# EAGLE schematic jkff v8 (EAGLE 9.7.0)
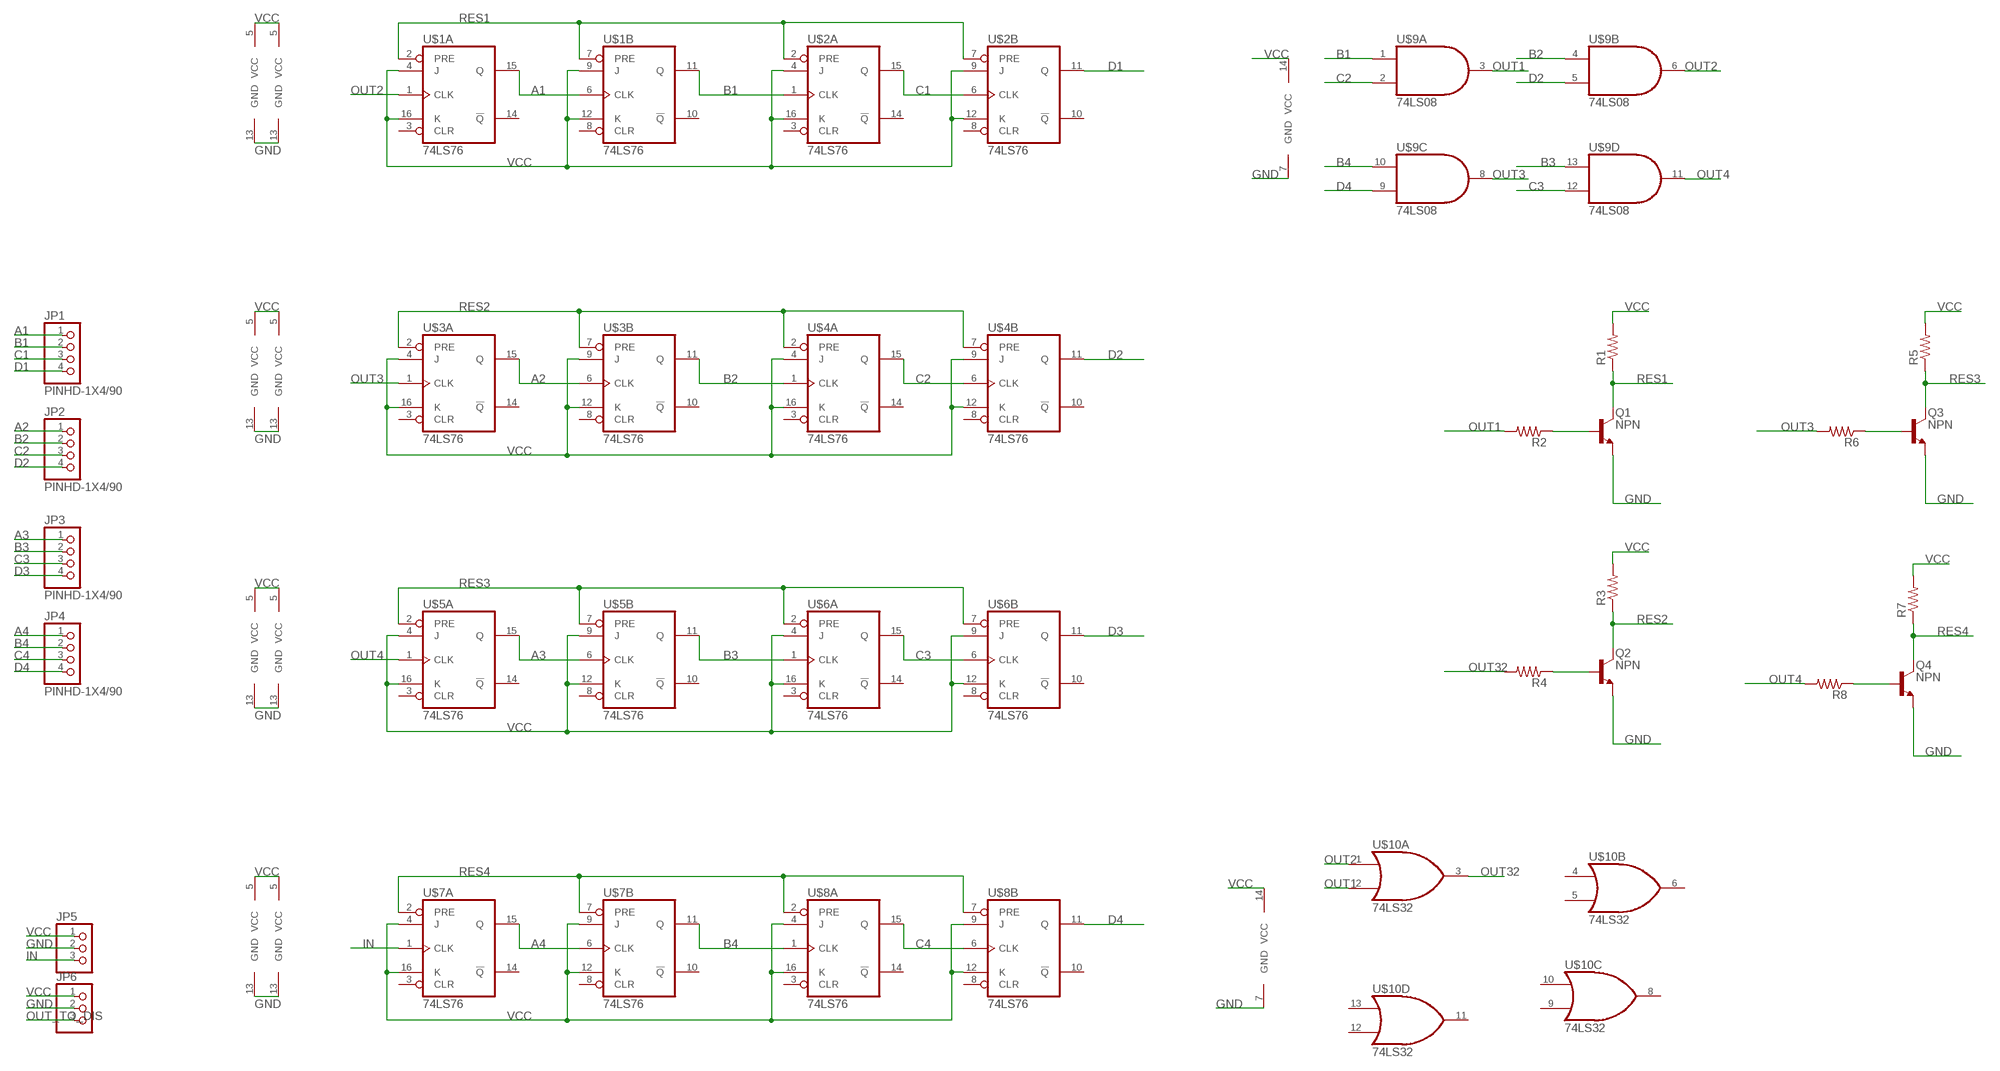
[diagram p0: schematic, sheet 1]

## Parts
JP1  PINHD-1X4/90  [1X04/90]
JP2  PINHD-1X4/90  [1X04/90]
JP3  PINHD-1X4/90  [1X04/90]
JP4  PINHD-1X4/90  [1X04/90]
JP5  PINHD-1X3CB  [1X03-CLEANBIG]
JP6  PINHD-1X3CB  [1X03-CLEANBIG]
Q1  NPN  NPN_TO92-EBC  [TO92]
Q2  NPN  NPN_TO92-EBC  [TO92]
Q3  NPN  NPN_TO92-EBC  [TO92]
Q4  NPN  NPN_TO92-EBC  [TO92]
R1  R-US_AXIAL-7.2MM-PITCH  [RESAD724W46L381D178B]
R2  R-US_AXIAL-7.2MM-PITCH  [RESAD724W46L381D178B]
R3  R-US_AXIAL-7.2MM-PITCH  [RESAD724W46L381D178B]
R4  R-US_AXIAL-7.2MM-PITCH  [RESAD724W46L381D178B]
R5  R-US_AXIAL-7.2MM-PITCH  [RESAD724W46L381D178B]
R6  R-US_AXIAL-7.2MM-PITCH  [RESAD724W46L381D178B]
R7  R-US_AXIAL-7.2MM-PITCH  [RESAD724W46L381D178B]
R8  R-US_AXIAL-7.2MM-PITCH  [RESAD724W46L381D178B]
U$1  74LS76  [DIO16]
U$2  74LS76  [DIO16]
U$3  74LS76  [DIO16]
U$4  74LS76  [DIO16]
U$5  74LS76  [DIO16]
U$6  74LS76  [DIO16]
U$7  74LS76  [DIO16]
U$8  74LS76  [DIO16]
U$9  74LS08  [DIO14]
U$10  74LS32  [DIO14]

## Nets
A1: JP1.1 U$1.6(B:CLK) U$1.15(A:Q)
A2: JP2.1 U$3.6(B:CLK) U$3.15(A:Q)
A3: JP3.1 U$5.6(B:CLK) U$5.15(A:Q)
A4: JP4.1 U$7.6(B:CLK) U$7.15(A:Q)
B1: JP1.2 U$1.11(B:Q) U$2.1(A:CLK) U$9.1(A:I0)
B2: JP2.2 U$3.11(B:Q) U$4.1(A:CLK) U$9.4(B:I0)
B3: JP3.2 U$5.11(B:Q) U$6.1(A:CLK) U$9.13(D:I0)
B4: JP4.2 U$7.11(B:Q) U$8.1(A:CLK) U$9.10(C:I0)
C1: JP1.3 U$2.6(B:CLK) U$2.15(A:Q)
C2: JP2.3 U$4.6(B:CLK) U$4.15(A:Q) U$9.2(A:I1)
C3: JP3.3 U$6.6(B:CLK) U$6.15(A:Q) U$9.12(D:I1)
C4: JP4.3 U$8.6(B:CLK) U$8.15(A:Q)
D1: JP1.4 U$2.11(B:Q)
D2: JP2.4 U$4.11(B:Q) U$9.5(B:I1)
D3: JP3.4 U$6.11(B:Q)
D4: JP4.4 U$8.11(B:Q) U$9.9(C:I1)
GND: JP5.2 JP6.2 Q1.1(E) Q2.1(E) Q3.1(E) Q4.1(E) U$1.13(GND) U$2.13(GND) U$3.13(GND) U$4.13(GND) U$5.13(GND) U$6.13(GND) U$7.13(GND) U$8.13(GND) U$9.7(GND) U$10.7(GND)
IN: JP5.3 U$7.1(A:CLK)
N$1: Q2.2(B) R4.1
N$7: Q3.2(B) R6.1
N$8: Q4.2(B) R8.1
N$16: Q1.2(B) R2.1
OUT1: R2.2 U$9.3(A:O) U$10.2(A:I1)
OUT2: U$1.1(A:CLK) U$9.6(B:O) U$10.1(A:I0)
OUT3: R6.2 U$3.1(A:CLK) U$9.8(C:O)
OUT4: R8.2 U$5.1(A:CLK) U$9.11(D:O)
OUT32: R4.2 U$10.3(A:O)
OUT_TO_DIS: JP6.3
RES1: Q1.3(C) R1.1 U$1.2(A:PRE) U$1.7(B:PRE) U$2.2(A:PRE) U$2.7(B:PRE)
RES2: Q2.3(C) R3.1 U$3.2(A:PRE) U$3.7(B:PRE) U$4.2(A:PRE) U$4.7(B:PRE)
RES3: Q3.3(C) R5.1 U$5.2(A:PRE) U$5.7(B:PRE) U$6.2(A:PRE) U$6.7(B:PRE)
RES4: Q4.3(C) R7.1 U$7.2(A:PRE) U$7.7(B:PRE) U$8.2(A:PRE) U$8.7(B:PRE)
VCC: JP5.1 JP6.1 R1.2 R3.2 R5.2 R7.2 U$1.4(A:J) U$1.5(VCC) U$1.9(B:J) U$1.12(B:K) U$1.16(A:K) U$2.4(A:J) U$2.5(VCC) U$2.9(B:J) U$2.12(B:K) U$2.16(A:K) U$3.4(A:J) U$3.5(VCC) U$3.9(B:J) U$3.12(B:K) U$3.16(A:K) U$4.4(A:J) U$4.5(VCC) U$4.9(B:J) U$4.12(B:K) U$4.16(A:K) U$5.4(A:J) U$5.5(VCC) U$5.9(B:J) U$5.12(B:K) U$5.16(A:K) U$6.4(A:J) U$6.5(VCC) U$6.9(B:J) U$6.12(B:K) U$6.16(A:K) U$7.4(A:J) U$7.5(VCC) U$7.9(B:J) U$7.12(B:K) U$7.16(A:K) U$8.4(A:J) U$8.5(VCC) U$8.9(B:J) U$8.12(B:K) U$8.16(A:K) U$9.14(VCC) U$10.14(VCC)
Unconnected: U$1.3(A:CLR) U$1.8(B:CLR) U$1.10(B:!Q) U$1.14(A:!Q) U$2.3(A:CLR) U$2.8(B:CLR) U$2.10(B:!Q) U$2.14(A:!Q) U$3.3(A:CLR) U$3.8(B:CLR) U$3.10(B:!Q) U$3.14(A:!Q) U$4.3(A:CLR) U$4.8(B:CLR) U$4.10(B:!Q) U$4.14(A:!Q) U$5.3(A:CLR) U$5.8(B:CLR) U$5.10(B:!Q) U$5.14(A:!Q) U$6.3(A:CLR) U$6.8(B:CLR) U$6.10(B:!Q) U$6.14(A:!Q) U$7.3(A:CLR) U$7.8(B:CLR) U$7.10(B:!Q) U$7.14(A:!Q) U$8.3(A:CLR) U$8.8(B:CLR) U$8.10(B:!Q) U$8.14(A:!Q) U$10.4(B:I0) U$10.5(B:I1) U$10.6(B:O) U$10.8(C:O) U$10.9(C:I1) U$10.10(C:I0) U$10.11(D:O) U$10.12(D:I1) U$10.13(D:I0)

## Library data of the parts
JP1-JP4 = Connector:PINHD-1X4: PIN HEADER; CATEGORY: CONNECTOR; SUB-CATEGORY: PIN-HEADER
JP5 JP6 = adafruit:PINHD-1X3: PIN HEADER
Q1-Q4 = Transistor:NPN: NPN - Generic; CATEGORY: Transistor; SUB-CATEGORY: BJT; TYPE: NPN
R1-R8 = Tutorial - Fusion 360:R-US: Resistor Fixed - ANSI; CATEGORY: Resistor; SUB-CATEGORY: Fixed
U$1-U$8 = Library:74LS76
U$9 = Library:74LS08
U$10 = Library:74LS32